# EAGLE design Lipo Module (EAGLE 6.3)
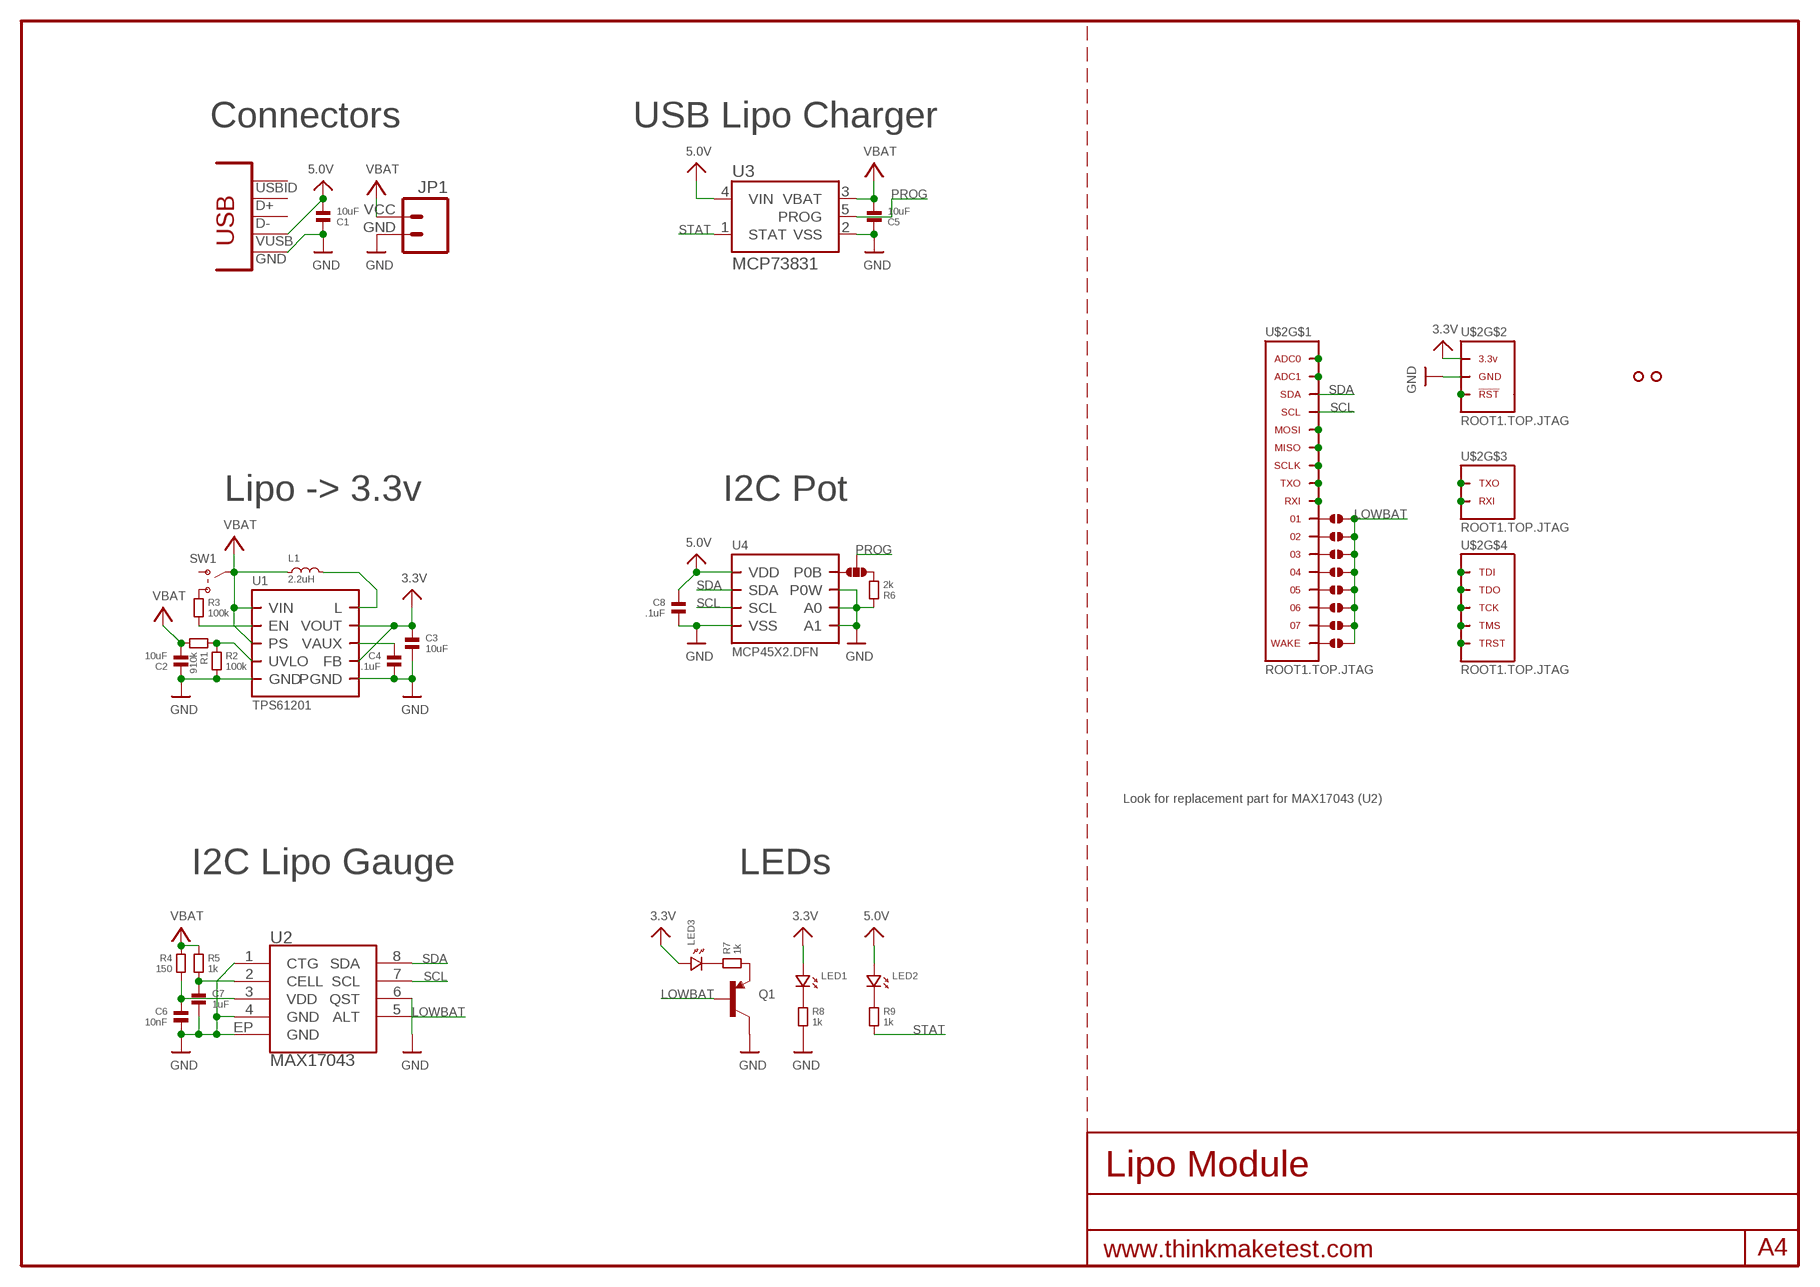
[diagram p0: schematic, sheet 1]

## Parts
C1  10uF  CAPACITOR.0805  [0805]
C2  10uF  CAPACITOR.0805  [0805]
C3  10uF  CAPACITOR.0805  [0805]
C4  .1uF  CAPACITOR.0603  [0603]
C5  10uF  CAPACITOR.0805  [0805]
C6  10nF  CAPACITOR.0603  [0603]
C7  1uF  CAPACITOR.0603  [0603]
C8  .1uF  CAPACITOR.0603  [0603]
J1  SOLDERJUMPER.3.LRG.23  [3.LRG.23]
J2  SOLDERJUMPER.2.SML  [2.SML]
J3  SOLDERJUMPER.2.SML  [2.SML]
J4  SOLDERJUMPER.2.SML  [2.SML]
J5  SOLDERJUMPER.2.SML  [2.SML]
J6  SOLDERJUMPER.2.SML  [2.SML]
J7  SOLDERJUMPER.2.SML  [2.SML]
J8  SOLDERJUMPER.2.SML  [2.SML]
J9  SOLDERJUMPER.2.SML  [2.SML]
JP1  M024UCON-15767  [JST-2-SMD-VERT]
L1  2.2uH  INDUCTOR-SRN3015  [SRN3015]
LED1  LED.0603  [0603.LED]
LED2  LED.0603  [0603.LED]
LED3  LED.0603  [0603.LED]
Q1  TRANSISTOR_PNPSOT23-REFLOW  [SOT23-R]
R1  910k  RESISTOR.0603  [0603]
R2  100k  RESISTOR.0603  [0603]
R3  100k  RESISTOR.0603  [0603]
R4  150  RESISTOR.0603  [0603]
R5  1k  RESISTOR.0603  [0603]
R6  2k  RESISTOR.0603  [0603]
R7  1k  RESISTOR.0603  [0603]
R8  1k  RESISTOR.0603  [0603]
R9  1k  RESISTOR.0603  [0603]
SW1  SSSS810701  [SSSS810701]
U1  TPS61201  TPS6120X  [DRC]
U2  MAX17043  MAX1704X  [TDFN-8]
U3  MCP73831  [SOT23-5]
U4  MCP45X2.DFN  [DFN-8.3X3.PAD]
U$2  ROOT1.TOP.JTAG  [ROOT1.TOP]
U$3  HOLE.2MM  [2MM]
U$4  HOLE.2MM  [2MM]
USB1  CON-USB-F-MICRO-B  [CONN_USB_MICRO-B]

## Nets
3.3V: C3.1 LED1.P$1 LED3.P$1 U1.2(VOUT) U1.10(FB) U$2.3.3V@1(3.3V) U$2.3.3V@2(3.3V) U$2.3.3V@3(3.3V) U$2.3.3V@4(3.3V) U$2.3.3V@5(3.3V) U$2.3.3V@6(3.3V) U$2.3.3V@7(3.3V) U$2.3.3V@8(3.3V) U$2.3.3V@9(3.3V) U$2.3.3V@10(3.3V) U$2.3.3V@11(3.3V) U$2.3.3V@12(3.3V)
5.0V: C1.2 C8.1 LED2.P$1 U3.4(VIN) U4.8(VDD) USB1.P1(VUSB)
GND: C1.1 C2.1 C3.2 C4.2 C5.1 C6.2 C7.2 C8.2 JP1.GND Q1.3(C) R2.2 R6.1 R8.2 U1.4(PGND) U1.9(GND) U1.PAD(PGND) U2.1(CTG) U2.4(GND) U2.6(QST) U2.EP(GND) U3.2(VSS) U4.1(A0) U4.4(VSS) U4.5(P0W) U4.7(A1) U4.PAD(VSS) U$2.GND@1(GND) U$2.GND@2(GND) U$2.GND@3(GND) U$2.GND@4(GND) U$2.GND@5(GND) U$2.GND@6(GND) U$2.GND@7(GND) U$2.GND@8(GND) U$2.GND@9(GND) U$2.GND@10(GND) U$2.GND@11(GND) U$2.GND@12(GND) U$2.GND@13(GND) USB1.P5(GND)
LOWBAT: J2.2 J3.2 J4.2 J5.2 J6.2 J7.2 J8.2 J9.2 Q1.1(B) U2.5(ALT)
N$1: J2.1 U$2.01
N$2: U$2.ADC1
N$3: LED2.P$2 R9.1
N$4: L1.2 U1.3(L)
N$5: J3.1 U$2.02
N$6: U$2.MISO
N$7: U$2.SCLK
N$8: U$2.TXO
N$9: U$2.RXI
N$10: J4.1 U$2.03
N$11: J5.1 U$2.04
N$12: U$2.MOSI
N$13: U$2.ADC0
N$14: J6.1 U$2.05
N$15: J7.1 U$2.06
N$16: J8.1 U$2.07
N$17: J9.1 U$2.WAKE
N$18: U$2.TDI
N$19: U$2.TDO
N$20: U$2.TCK
N$21: U$2.TMS
N$22: U$2.TRST
N$23: U$2.RXI.DBG(RXI)
N$24: U$2.TXO.DBG(TXO)
N$25: U$2.RST(!RST)
N$26: R3.1 SW1.1(B)
N$27: C6.1 R4.2 U2.3(VDD)
N$28: C7.1 R5.2 U2.2(CELL)
N$29: J1.1 U4.6(P0B)
N$31: J1.3 R6.2
N$32: LED1.P$2 R8.1
N$36: R3.2 U1.6(EN)
N$37: Q1.2(E) R7.2
N$38: LED3.P$2 R7.1
N$39: C4.1 U1.1(VAUX)
N$40: R1.1 R2.1 U1.7(UVLO)
PROG: J1.2 U3.5(PROG)
SCL: U2.7(SCL) U4.2(SCL) U$2.SCL
SDA: U2.8(SDA) U4.3(SDA) U$2.SDA
STAT: R9.2 U3.1(STAT)
VBAT: C2.2 C5.2 JP1.VCC L1.1 R1.2 R4.1 R5.1 SW1.2(COM) U1.5(VIN) U1.8(PS) U3.3(VBAT)
Unconnected: SW1.3(A) USB1.BODY@1(BODY) USB1.BODY@2(BODY) USB1.BODY@3(BODY) USB1.BODY@4(BODY) USB1.P2(D-) USB1.P3(D+) USB1.P4(USBID)

## Notes on the sheet
- Connectors | USB Lipo Charger
- Lipo -> 3.3v | I2C Pot
- Look for replacement part for MAX17043 (U2)
- I2C Lipo Gauge | LEDs

## Library data of the parts
C1-C8 = .standardparts:CAPACITOR
J1 = .solderjumper:SOLDERJUMPER.3
J2-J9 = .solderjumper:SOLDERJUMPER.2
JP1 = SparkFun:M02: Header 2 Standard 2-pin 0.1" header. Use with straight break away headers (SKU : PRT-00116), right angle break away headers (PRT-00553), swiss pins (PRT-00743), machine pins (PRT-00117), and female headers (PRT-00115). Molex polarized connector foot print use with SKU : PRT-08233 with associated crimp pins and housings.
L1 = bourns:INDUCTOR
LED1-LED3 = .standardparts:LED
Q1 = microbuilder:TRANSISTOR_PNP: PNP Transistor Transistor (PNP) 800mA 60V [Digikey: MMBT2907AFSTR-ND] SOT23-R - SOT23 footprint optimised for use with solder paste and reflow ovens. SOT23-W - SOT23 footprint optimised for hand-soldering (larger pads).
R1-R9 = .standardparts:RESISTOR
SW1 = alps:SSSS810701
U1 = .packages(ti):TPS6120X
U2 = SparkFun:MAX1704X: MAX17043/MAX17044: Battery Fuel Guage (43 is 1cell, 44 is 2cell)
U3 = SparkFun:MCP73831: Microchip's MCP73831 Miniature single cell, fully integrated Li-Ion, Li-polymer charge management controller http://ww1.microchip.com/downloads/en/DeviceDoc/21984a.pdf
U4 = microchip:MCP45X2
U$2 = thinkmaketest:ROOT1
U$3 U$4 = .screw_holes:HOLE
USB1 = dp_devices:CON-USB-F: USB Female connector

## Board
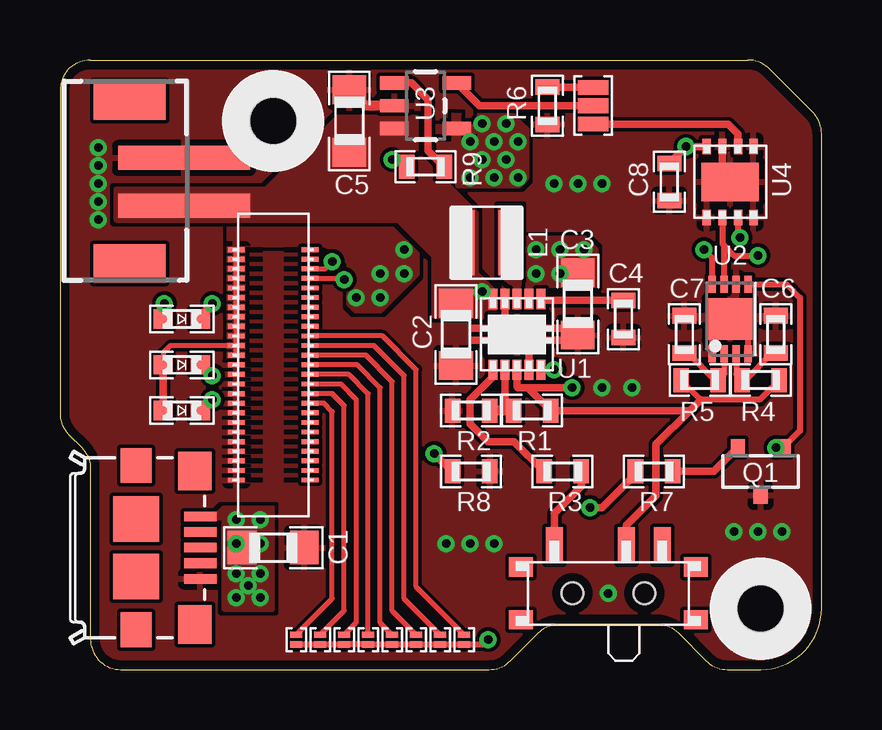
[diagram p1: board, top side]
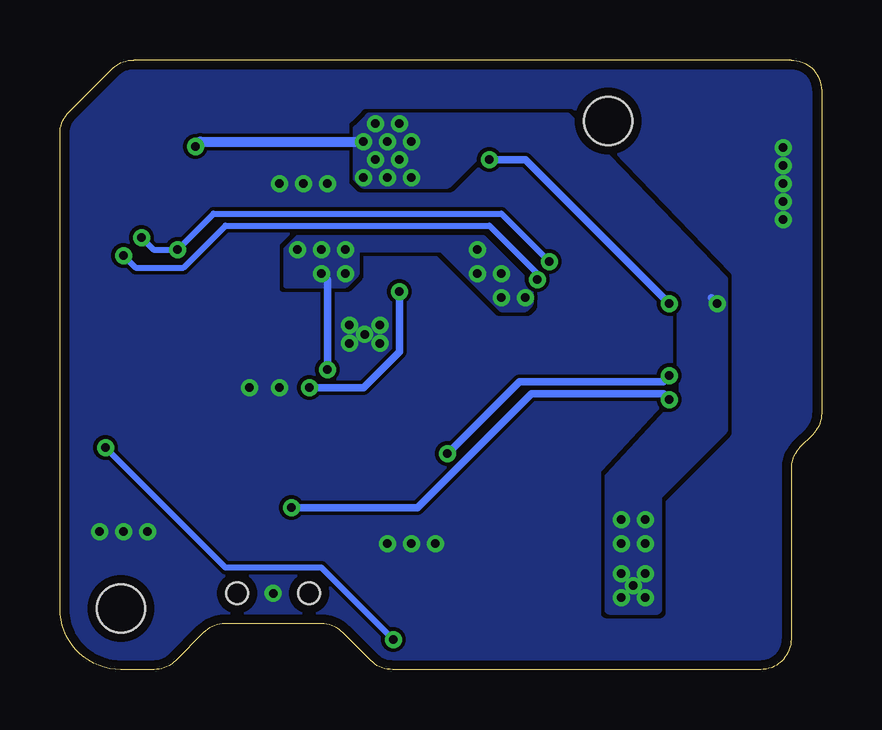
[diagram p2: board, bottom side, seen from below]

Size 31.75 x 25.4 mm. Coordinates in mm from the lower left corner, seen from the top.
Outline: 1.27,25.4 28.68,25.4 arc-45 29.58,25.03 31.38,23.23 arc-45 31.75,22.33 31.75,2.54 arc-90 29.21,0 27.83,0 arc-45 26.93,0.37 25.77,1.53 arc45 24.87,1.91 20.85,1.91 arc45 19.95,1.53 18.79,0.37 arc-45 17.89,0 2.54,0 arc-90 1.27,1.27 1.27,8.36 arc45 0.9,9.26 0.37,9.79 arc-45 0,10.69 0,24.13 arc-90 1.27,25.4
Copper layers (1*16): Top 0.0356mm / dielectric 1.5011mm / Bottom 0.0356mm
Design rules "OSHPark": minimum track width 6mil, minimum drill 13mil, track to track 6mil, track to pad 6mil, pad to pad 6mil, via to via 6mil, smd to smd 6mil, copper to edge 15mil, drill to drill 6mil, minimum pad ring 7mil, minimum via ring 7mil, stop-mask expansion 4mil, vias tented up to drill 16mil, thermal gap 10mil

### Footprints (pad centres in the part's own frame; a part is rotated, then mirrored left to right if it is on the bottom)
0805 = smd 1.2 x 1.4: 1 -1.3,0; 2 1.3,0
0603 = smd 0.65 x 1: 1 -0.775,0; 2 0.775,0
3.LRG.23 = smd 0.61 x 1.27: 1 -0.762,0; 2 0,0; 3 0.762,0
2.SML = smd 0.254 x 0.508: 1 -0.203,0; 2 0.203,0
JST-2-SMD-VERT = smd 1 x 5.5: GND 1,-2; VCC -1,-2 | smd 1.6 x 3: P$1 -3.4,0.27; P$2 3.4,0.27
SRN3015 = smd 2.7 x 1: 1 0,1; 2 0,-1
0603.LED = smd 0.8 x 0.8: P$1 -0.775,0; P$2 0.775,0
SOT23-R = smd 0.6 x 0.7: 1 -0.95,-1; 2 0.95,-1; 3 0,1
SSSS810701 = smd 0.7 x 1.5: 1 -2.25,2; 2 0.75,2; 3 2.25,2 | smd 1 x 0.8: 4.1 -3.65,1.1; 4.2 3.65,1.1; 4.3 -3.65,-1.1; 4.4 3.65,-1.1 | hole 0.9: 1.5,0; -1.5,0
DRC = smd 0.38 x 0.85: 1 -1,-1.475; 2 -0.5,-1.475; 3 0,-1.475; 4 0.5,-1.475; 5 1,-1.475; 6 1,1.475; 7 0.5,1.475; 8 0,1.475; 9 -0.5,1.475; 10 -1,1.475 | smd 2.4 x 1.65: PAD 0,0
TDFN-8 = smd 0.7 x 0.3: 1 -1.45,0.75; 2 -1.45,0.25; 3 -1.45,-0.25; 4 -1.45,-0.75; 5 1.45,-0.75; 6 1.45,-0.25; 7 1.45,0.25; 8 1.45,0.75 | smd 1.73 x 1.88: EP 0,0
SOT23-5 = smd 0.55 x 1.2: 1 -0.95,-1.3; 2 0,-1.3; 3 0.95,-1.3; 4 0.95,1.3; 5 -0.95,1.3
DFN-8.3X3.PAD = smd 0.35 x 0.65: 1 -0.975,-1.475; 2 -0.325,-1.475; 3 0.325,-1.475; 4 0.975,-1.475; 5 0.975,1.475; 6 0.325,1.475; 7 -0.325,1.475; 8 -0.975,1.475 | smd 2.4 x 1.6: PAD 0,0
ROOT1.TOP = smd 0.7 x 0.2: 01 4.08,13.9; 02 4.08,13.5; 03 4.08,13.1; 3.3V@1 1,17.5; 3.3V@2 1,17.1; 3.3V@3 1,16.7; 3.3V@4 1,16.3; 3.3V@5 1,15.9; 3.3V@6 1,15.5; 3.3V@7 1,15.1; 3.3V@8 1,14.7; 3.3V@9 1,14.3; 3.3V@10 1,13.9; 3.3V@11 1,13.5; 3.3V@12 1,13.1; 04 4.08,12.7; 05 4.08,12.3; 06 4.08,11.9; 07 4.08,11.5; ADC0 4.08,17.5; ADC1 4.08,17.1; GND@1 1,7.9; GND@2 1,8.3; GND@3 1,8.7; GND@4 1,9.1; GND@5 1,9.5; GND@6 1,9.9; GND@7 1,10.3; GND@8 1,10.7; GND@9 1,11.1; GND@10 1,11.5; GND@11 1,11.9; GND@12 1,12.3; GND@13 1,12.7; MISO 4.08,15.5; MOSI 4.08,15.9; RST 4.08,7.9; RXI 4.08,14.3; RXI.DBG 4.08,10.3; SCL 4.08,16.3; SCLK 4.08,15.1; SDA 4.08,16.7; TCK 4.08,9.1; TDI 4.08,9.9; TDO 4.08,9.5; TMS 4.08,8.7; TRST 4.08,8.3; TXO 4.08,14.7; TXO.DBG 4.08,10.7; WAKE 4.08,11.1
2MM = hole 2: 0,0
CONN_USB_MICRO-B = smd 1.6 x 1.4: BODY@1 -3.2,2.45; BODY@2 3.2,2.45 | smd 1.45 x 1.3: BODY@3 3.425,0; BODY@6 -3.425,0 | smd 1.9 x 1.9: BODY@4 1.2,0; BODY@5 -1.2,0 | smd 0.4 x 1.35: P1 -1.3,2.675; P2 -0.65,2.675; P3 0,2.675; P4 0.65,2.675; P5 1.3,2.675

### Placement (x,y rotation side)
C1  8.89,5.08 180 top
C2  16.51,13.97 90 top
C3  21.59,15.24 270 top
C4  23.49,14.61 270 top
C5  12.06,22.86 270 top
C6  29.84,13.97 90 top
C7  26.03,13.97 90 top
C8  25.4,20.32 270 top
J1  22.23,23.5 90 top
J2  16.85,1.25 270 top
J3  15.85,1.25 270 top
J4  14.85,1.25 270 top
J5  13.85,1.25 270 top
J6  12.85,1.25 270 top
J7  11.85,1.25 270 top
J8  10.85,1.25 270 top
J9  9.85,1.25 270 top
JP1  3.17,20.32 90 top
L1  17.78,17.78 90 top
LED1  5.08,12.7 0 top
LED2  5.08,14.61 0 top
LED3  5.08,10.79 0 top
Q1  29.21,8.26 180 top
R1  19.69,10.79 0 top
R2  17.14,10.79 180 top
R3  20.95,8.26 180 top
R4  29.21,12.06 180 top
R5  26.67,12.06 0 top
R6  20.32,23.5 90 top
R7  24.77,8.26 0 top
R8  17.14,8.26 0 top
R9  15.24,20.95 0 top
SW1  22.86,3.17 0 top
U1  19.05,13.97 180 top
U2  27.94,14.61 90 top
U3  15.24,23.5 270 top
U4  27.94,20.32 0 top
U$2  6.35,0 0 top
U$3  29.21,2.54 90 top
U$4  8.89,22.86 90 top
USB1  3.17,5.08 270 top

### Tracks (layer width: path | path; a pad name or v marks a point on that pad's centre or on a via)
3.3V  (via drill 0.36)
  Top 0.203: U$2.3.3V@12 U$2.3.3V@11 | U$2.3.3V@11 U$2.3.3V@10 U$2.3.3V@9 U$2.3.3V@8 U$2.3.3V@7 U$2.3.3V@6 U$2.3.3V@5 U$2.3.3V@4 U$2.3.3V@3 U$2.3.3V@2 U$2.3.3V@1 | U$2.3.3V@11 4.6,13.5 4.3,13.21 LED1.P$1
  Top 0.305: LED3.P$1 LED1.P$1 | U1.10 v20.59,12.49 v20.6,12.5
  Bottom 0.305: v20.6,12.5 20.6,16.25 v20.85,16.5
  other vias: 19.85,16.5 19.85,17.5 20.85,17.5 21.85,17.5 14.35,17.5 13.35,16.5 14.35,16.5 12.35,15.5 13.35,15.5
  pour Top (rank 2, no thermals): 19.45,15.1 19.45,18 21.85,18 22.35,17.5 22.35,16 19.85,16 19.65,15.8 19.65,15.1
  pour Bottom (rank 2, no thermals): 21.85,18 22.35,17.5 22.35,16 19.85,16 19.35,16.5 19.35,17.5 15.85,17.5 13.35,15 12.35,15 12.1,15.25 12.1,16 14.1,18
  pour Top (rank 2): 13.35,15 14.85,16.5 14.85,17.75 14.1,18.5 7.1,18.5 7.1,13 7.6,13 7.6,17.75 11.1,17.75 12.1,17 12.1,15.25 12.35,15
5.0V  (via drill 0.36)
  Top 0.305: U4.8 v26.1,21.8 C8.1 | LED2.P$1 4.35,14.65 v4.35,15.25
  Bottom 0.305: v4.35,15.25 4.6,15.5
  Bottom 0.406: v26.1,21.8 25.9,22 v19.1,22
  other vias: 7.35,6.25 7.35,5.25 7.85,3.5 7.35,3 7.35,4 8.35,3 8.35,4 8.35,5.25 8.35,6.25 17.6,22.75 18.6,22.75 18.1,22 17.1,22 17.6,21.25 18.6,21.25 18.1,20.5 19.1,20.5 17.1,20.5
  pour Top (no thermals): 5.35,6.45 6.55,6.45 6.85,6.75 8.85,6.75 8.85,2.5 6.85,2.5 6.85,6.3 5.35,6.3
  pour Bottom: 6.85,2.5 6.85,7.25 4.1,10 4.1,16.25 10.6,23 18.85,23 19.35,22.5 19.35,20.5 19.1,20.25 15.6,20.25 14.35,21.5 12.35,21.5 5.85,15 5.85,11.25 8.85,8 8.85,2.5
  pour Top: 16.35,23 18.85,23 19.35,22.5 19.35,20.5 19.1,20.25 16.6,20.25 15.6,21.25 15.6,23
GND  (via drill 0.36)
  Top 0.254: U2.4 28.69,13.86 U2.EP 27.19,13.86 U2.1
  Top 0.305: U1.9 19.55,13.47 U1.PAD 18.55,14.47 U1.4 | U4.7 27.62,20.64 U4.PAD
  Top 0.406: U3.2 12.73,23.5 C5.1
  other vias: 1.6,20.25 19.05,13.97 19.69,14.35 19.69,13.59 18.41,13.59 18.41,14.35 22.86,3.17 1.6,21 1.6,21.75 1.6,19.5 1.6,18.75 22.6,11.75 23.85,11.75 20.6,20.25 21.6,20.25 22.6,20.25 28.1,5.75 29.1,5.75 30.1,5.75 16.1,5.25 17.1,5.25 18.1,5.25
  pour Bottom (rank 6): 0,0 31.75,0 31.75,25.4 0,25.4
  pour Top (rank 6): 0,0 31.75,0 31.75,25.4 0,25.4
LOWBAT  (via drill 0.36)
  Top 0.254: J9.2 J8.2 J7.2 J6.2 J5.2 J4.2 J3.2 J2.2 17.65,1.05 v17.85,1.25 | U2.5 30.3,16.05 30.85,15.5 30.85,9.95 Q1.1 v29.85,9.25
  Bottom 0.254: v17.85,1.25 20.85,4.25 24.85,4.25 v29.85,9.25
N$1
  Top 0.203: U$2.01 13.45,13.9 14.85,12.5 14.85,3.45 J2.1
N$3  (via drill 0.36)
  Top 0.305: v13.85,21.25 14.17,21.25 R9.1 | v6.35,15.25 5.85,14.76 LED2.P$2
  Bottom 0.305: v13.85,21.25 12.35,21.25 v6.35,15.25
N$4
  pour Top (no thermals): 19.15,15.1 19.15,16.3 19.2,16.35 19.2,19.25 18.35,19.25 18.35,16.5 18.95,16 18.95,15.1
N$5
  Top 0.203: U$2.02 13.1,13.5 14.35,12.25 14.35,2.95 J3.1
N$10
  Top 0.203: U$2.03 12.75,13.1 13.85,12 13.85,2.45 J4.1
N$11
  Top 0.203: U$2.04 12.4,12.7 13.35,11.75 13.35,1.95 J5.1
N$14
  Top 0.203: J6.1 12.85,11.5 12.05,12.3 U$2.05
N$15
  Top 0.203: U$2.06 11.7,11.9 12.35,11.25 12.35,1.95 J7.1
N$16
  Top 0.203: U$2.07 11.35,11.5 11.85,11 11.85,2.45 J8.1
N$17
  Top 0.203: U$2.WAKE 11,11.1 11.35,10.75 11.35,2.95 J9.1
N$26
  Top 0.305: R3.1 21.73,7.63 20.61,6.51 SW1.1
N$27
  Top 0.254: U2.3 28.19,12.31 R4.2 28.58,12.06 29.7,13.2 C6.1
N$28
  Top 0.254: U2.2 27.69,12.31 R5.2 27.3,12.06 26.17,13.2 C7.1
N$29
  Top 0.305: U4.6 28.27,22.34 27.87,22.73 J1.1
N$31
  Top 0.305: J1.3 20.33,24.26 R6.2
N$32  (via drill 0.36)
  Top 0.305: v6.35,12.25 5.9,12.7 LED1.P$2 | v15.6,9 16.34,8.26 R8.1
  Bottom 0.305: v15.6,9 12.6,12 6.6,12 v6.35,12.25
N$36
  Top 0.305: U1.6 18.05,12.2 17.1,11.25 17.1,10.25 17.85,9.5 18.94,9.5 R3.2
N$37
  Top 0.305: Q1.2 27.26,8.26 R7.2
N$38  (via drill 0.36)
  Top 0.305: v6.35,11.25 5.89,10.79 LED3.P$2 | R7.1 23.99,8.14 22.6,6.75 v22.1,6.75
  Bottom 0.305: v6.35,11.25 6.6,11.5 12.1,11.5 16.85,6.75 v22.1,6.75
N$39
  Top 0.305: C4.1 20.12,15.38 U1.1
N$40
  Top 0.305: U1.7 18.55,11.15 R1.1
  Top 0.406: R1.1 R2.1
PROG
  Top 0.305: J1.2 17.49,23.5 U3.5
SCL  (via drill 0.36)
  Top 0.203: U$2.SCL 11.8,16.3 v11.85,16.25
  Top 0.254: U4.2 27.62,17.73 27.69,17.66 | v29.1,17.25 28.1,17.25 27.69,17.66 | U2.7 27.69,17.66
  Bottom 0.254: v29.1,17.25 28.6,16.75 26.6,16.75 24.85,18.5 13.85,18.5 11.85,16.5 v11.85,16.25
SDA  (via drill 0.36)
  Top 0.203: U$2.SDA 11.05,16.7 v11.35,17
  Top 0.254: U4.3 28.27,18.09 v28.35,18 | U2.8 27.19,17.16 v26.85,17.5
  Bottom 0.254: v28.35,18 27.85,17.5 v26.85,17.5 25.35,19 13.35,19 v11.35,17
STAT
  Top 0.305: U3.1 14.65,24.45 15.35,23.75 15.35,21.62 R9.2
VBAT  (via drill 0.36)
  Top 0.254: R4.1 29.17,11.25 26.71,11.25 R5.1
  Top 0.305: 26.71,11.25 26.26,10.79 | 26.26,10.79 24.85,9.39 24.85,7.25 23.61,6.01 SW1.2 | U1.8 19.05,11.8 19.1,11.75 19.5,11.75 | 19.5,11.75 R1.2 26.26,10.79 | v17.6,15.75 17.74,15.75 U1.5 | 19.5,11.75 v21.35,11.75
  Bottom 0.305: v17.6,15.75 17.6,13.25 19.1,11.75 v21.35,11.75
  pour Top (no thermals): 2.35,18.75 14.1,18.75 15.6,17.25 15.6,14.75 17.85,14.75 18.1,15 18.1,15.75 17.35,16.5 17.35,19 14.85,21.5 14.85,23 11.6,23 8.6,20 2.35,20

### Text on the board
tDocu: 500mA | ADJ | CRG | PWR | LOW | ON | OFF | 8 | 7 | 6 | 5 | 4 | 3 | 2 | 1 | Low / Batt
bDocu: Cruz Monrreal II | InnovativeMaker.com | v1